# Altium schematic sheet PTC_Heater_V2.SchDoc
size 420 x 297 mm; ENG_APP_DATE: --/--/--; DSN_APP_DATE: --/--/--; CHK_APP_DATE: --/--/--
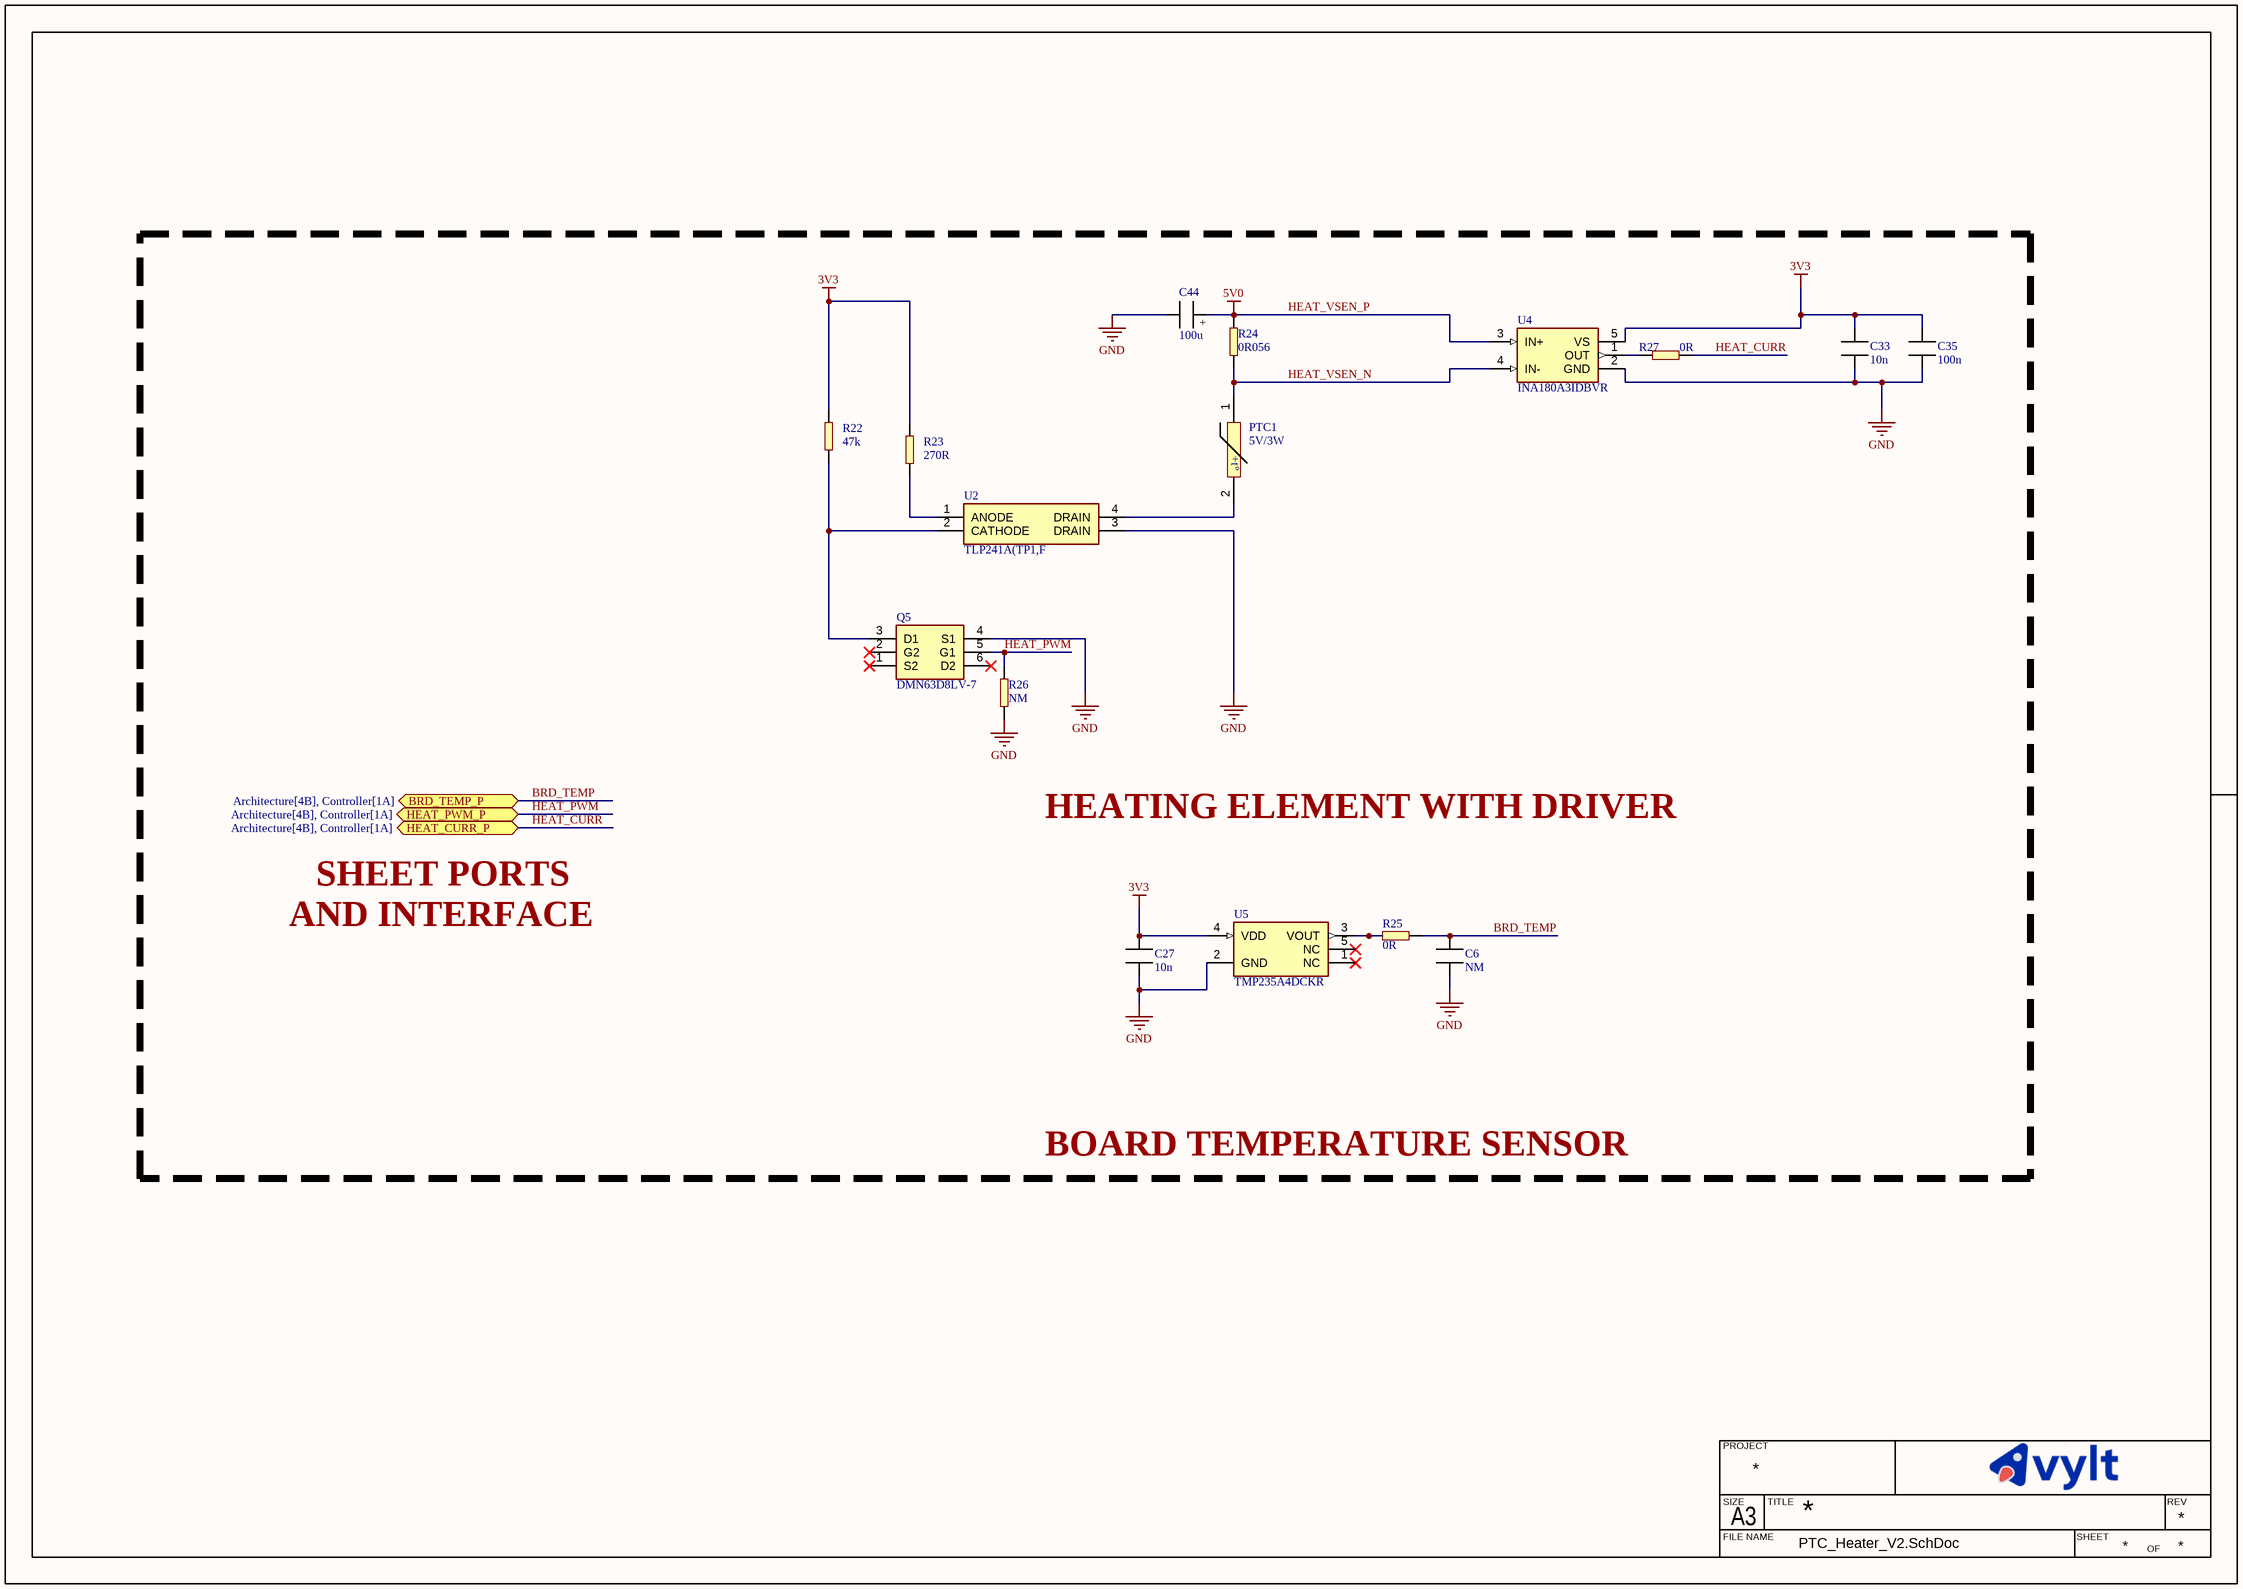
[diagram p0: PTC_Heater_V2.SchDoc]

## Parts
C6  value NM  [CAPC1608X10N]  (hidden comment: ERP_102-1)  (no BOM)
C27  value 10n  [CAPC1608X10N]  (hidden comment: ERP_102-1)
C33  value 10n  [CAPC1608X10N]  (hidden comment: ERP_102-1)
C35  value 100n  [CAPC1608X10N]  (hidden comment: ERP_102-1)
C44  value 100u  [CAP_6.3_7.7]  (hidden comment: ERP_102-2)
PTC1  value 5V/3W  [FIT0844]  (hidden comment: FIT0844)
Q5  value DMN63D8LV-7  [DMN63D8LV]  (hidden comment: DMN63D8LV)
R22  value 47k  [RES_0603]  (hidden comment: ERP_101-1)
R23  value 270R  [RES_0603]  (hidden comment: ERP_101-1)
R24  value 0R056  [RESC3115X06N]  (hidden comment: ERP_101-1)
R25  value 0R  [RES_0603]  (hidden comment: ERP_101-1)
R26  value NM  [RES_0603]  (hidden comment: ERP_101-1)  (no BOM)
R27  value 0R  [RES_0603]  (hidden comment: ERP_101-1)
U2  value TLP241A(TP1,F  [TLP241A]  (hidden comment: TLP241A)
U4  value INA180A3IDBVR  [INA180]  (hidden comment: INA180)
U5  value TMP235A4DCKR  [TMP235]  (hidden comment: TMP235)

## Ports
BRD_TEMP_P (bidir, see Architecture[4B], Controller[1A]), HEAT_CURR_P (bidir, see Architecture[4B], Controller[1A]), HEAT_PWM_P (bidir, see Architecture[4B], Controller[1A])

## Nets
3V3: C27.2 C33.2 C35.2 R22.2 R23.2 U4.5(VS) U5.4(VDD)
GND: C6.1 C27.1 C33.1 C35.1 C44.2 Q5.4(S1) R26.2 U2.3(DRAIN) U4.2(GND) U5.2(GND)
HEAT_VSEN_P: C44.1 R24.2 U4.3(IN+)  [also labelled 5V0]
BRD_TEMP: C6.2 R25.2 ; port BRD_TEMP_P
HEAT_CURR: R27.1 ; port HEAT_CURR_P
HEAT_PWM: Q5.5(G1) R26.1 ; port HEAT_PWM_P
HEAT_VSEN_N: PTC1.1 R24.1 U4.4(IN-)
NetPTC1_2: PTC1.2 U2.4(DRAIN)
NetQ5_3: Q5.3(D1) R22.1 U2.2(CATHODE)
NetR23_1: R23.1 U2.1(ANODE)
NetR25_1: R25.1 U5.3(VOUT)
NetR27_2: R27.2 U4.1(OUT)

Not connected (* = marked no-connect by the designer): Q5 1(S2)* 2(G2)* 6(D2)*; U5 1(NC)* 5(NC)*

## Notes on the sheet
- HEATING ELEMENT WITH DRIVER
- AND INTERFACE
- SHEET PORTS
- BOARD TEMPERATURE SENSOR
- PROJECT
- SIZE
- FILE NAME
- A3
- TITLE
- SHEET
- OF
- REV
- (in symbol CAP_6.3_7.7) +
- (in symbol FIT0844) +t°

## Library data of the parts
C6 = MLCC_0603: Chip Capacitor, 2-Leads, Body 1.60x0.80mm, IPC Medium Density; Package: 0603; Manufacturer 1: *; Manufacturer Part Number 1: *; Supplier 1: *; Suuplier Part Number 1: *; ERP: *
C27 = MLCC_0603: Manufacturer 1: Murata; Manufacturer Part Number 1: GRM1885C1H103JA01D; Package: 0603; Suuplier Part Number 1: *; ERP: *; Supplier 1: Digikey; Supplier Part Number 1: 490-9666-1-ND
C33 = MLCC_0603: Chip Capacitor, 2-Leads, Body 1.60x0.80mm, IPC Medium Density; Manufacturer 1: Murata; Manufacturer Part Number 1: GRM1885C1H103JA01D; Package: 0603; Suuplier Part Number 1: *; ERP: *; Supplier 1: Digikey; Supplier Part Number 1: 490-9666-1-ND
C35 = MLCC_0603: Chip Capacitor, 2-Leads, Body 1.60x0.80mm, IPC Medium Density; Manufacturer 1: Murata; Manufacturer Part Number 1: CC0603JRX7R9BB104; Package: 0603; Supplier 1: *; Suuplier Part Number 1: *; ERP: *
C44 = CAP_6.3_7.7: Electrolytic Capacitor SMD 6.3x7.7; Manufacturer 1: Nichicon; Manufacturer Part Number 1: UWT1V101MCL1GS; Suuplier Part Number 1: 493-2203-1-ND; Package: 6.3x7.7; ERP: *; Supplier 1: Digikey; Supplier Part Number 1: 493-2203-1-ND
PTC1 = FIT0844: PTC HEATER 5V 3W; Manufacturer 1: DFRobot; ERP: *; Supplier Part Number 1: *; Supplier 1: *; Package: Chassis Mount; Manufacturer Part Number 1: FIT0844
Q5 = DMN63D8LV: MOSFET 2N-CH 30V 0.26A SOT563; Manufacturer 1: Diodes Incorporated; ERP: *; Supplier Part Number 1: *; Supplier 1: *; Package: SOT563; Manufacturer Part Number 1: DMN63D8LV-7
R22 = RES_0603: Manufacturer 1: YAGEO; Manufacturer Part Number 1: RC0603FR-0747KL; Package: 0603; ERP: *; Supplier 1: *; Supplier Part Number 1: *; Supplier 2: Digikey; Supplier Part Number 2: 311-47.0KHRCT-ND
R23 = RES_0603: Manufacturer 1: YAGEO; Manufacturer Part Number 1: RC0603JR-07270RL; Package: 0603; ERP: *; Supplier 1: *; Supplier Part Number 1: *; Supplier 2: Digikey; Supplier Part Number 2: 311-270GRCT-ND
R24 = RES_1206: RES_0805; Manufacturer 1: TE Connectivity Passive Product; Manufacturer Part Number 1: RLC73PN2BR056FTD; Package: 1206; Supplier  1: *; Supplier  Part Number 1: *; ERP: *; Supplier 1: Digikey; Supplier Part Number 1: 1712-RLC73PN2BR056FTDCT-ND
R25 R27 = RES_0603: Manufacturer 1: YAGEO; Manufacturer Part Number 1: RC0603JR-070RL; Package: 0603; ERP: *; Supplier 1: Digikey; Supplier Part Number 1: 311-0.0GRCT-ND
R26 = RES_0603: Package: 0603; Manufacturer 1: *; Manufacturer Part Number 1: *; Supplier 1: *; Supplier Part Number 1: *; ERP: *
U2 = TLP241A: SSR RELAY SPST-NO 2A 0-40V; Manufacturer 1: Toshiba Semiconductor and Storage; ERP: *; Supplier Part Number 1: *; Supplier 1: *; Package: 4 Pin SMD; Manufacturer Part Number 1: TLP241A
U4 = INA180: Manufacturer 1: Texas Instruments; Manufacturer Part Number 1: INA180A3IDBVR; Package: SOT23-5; ERP: *; Supplier 1: *; Supplier Part Number 1: *; Supplier 2: Digikey; Supplier Part Number 2: 296-47654-1-ND
U5 = TMP235: Manufacturer 1: Texas Instruments; Manufacturer Part Number 1: TMP235A4DCKR; ERP: *; Package: SOT-353; Supplier 1: *; Supplier Part Number 1: *; Supplier 2: Digikey; Supplier Part Number 2: 296-50016-1-ND